# Altium schematic sheet power_supply.SchDoc
size A4; DocumentNumber: 4; SheetNumber: 4; SheetTotal: 4
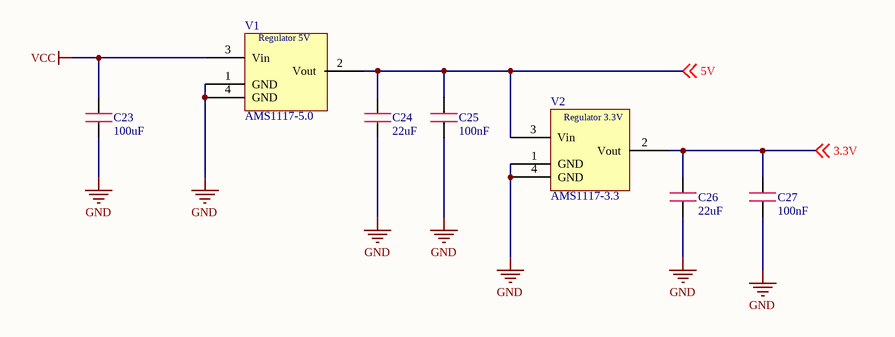
[diagram p0: power_supply.SchDoc]

## Parts
C23  value 100uF  [C0402]  (hidden comment: Capacity)
C24  value 22uF  [C0402]  (hidden comment: Capacity)
C25  value 100nF  [C0402]  (hidden comment: Capacity)
C26  value 22uF  [C0402]  (hidden comment: Capacity)
C27  value 100nF  [C0402]  (hidden comment: Capacity)
V1  AMS1117-5.0  [SOT-223]
V2  AMS1117-3.3  [SOT-223]

## Nets
GND: C23.2 C24.2 C25.2 C26.2 C27.2 V1.1(GND) V1.4(GND) V2.1(GND) V2.4(GND)
VCC: C23.1 V1.3(Vin)
3.3V: C26.1 C27.1 V2.2(Vout) ; off-sheet 3.3V
5V: C24.1 C25.1 V1.2(Vout) V2.3(Vin) ; off-sheet 5V

## Notes on the sheet
- (in symbol AMS1117-3.3) Regulator 3.3V
- (in symbol AMS1117-5.0) Regulator 5V

## Library data of the parts
V1 = AMS1117-5.0: Linear Voltage Regulator 5V
V2 = AMS1117-3.3: Linear Voltage Regulator 3.3V